# Altium schematic sheet radio.SchDoc
size A4; SheetNumber: 8; SheetTotal: 8
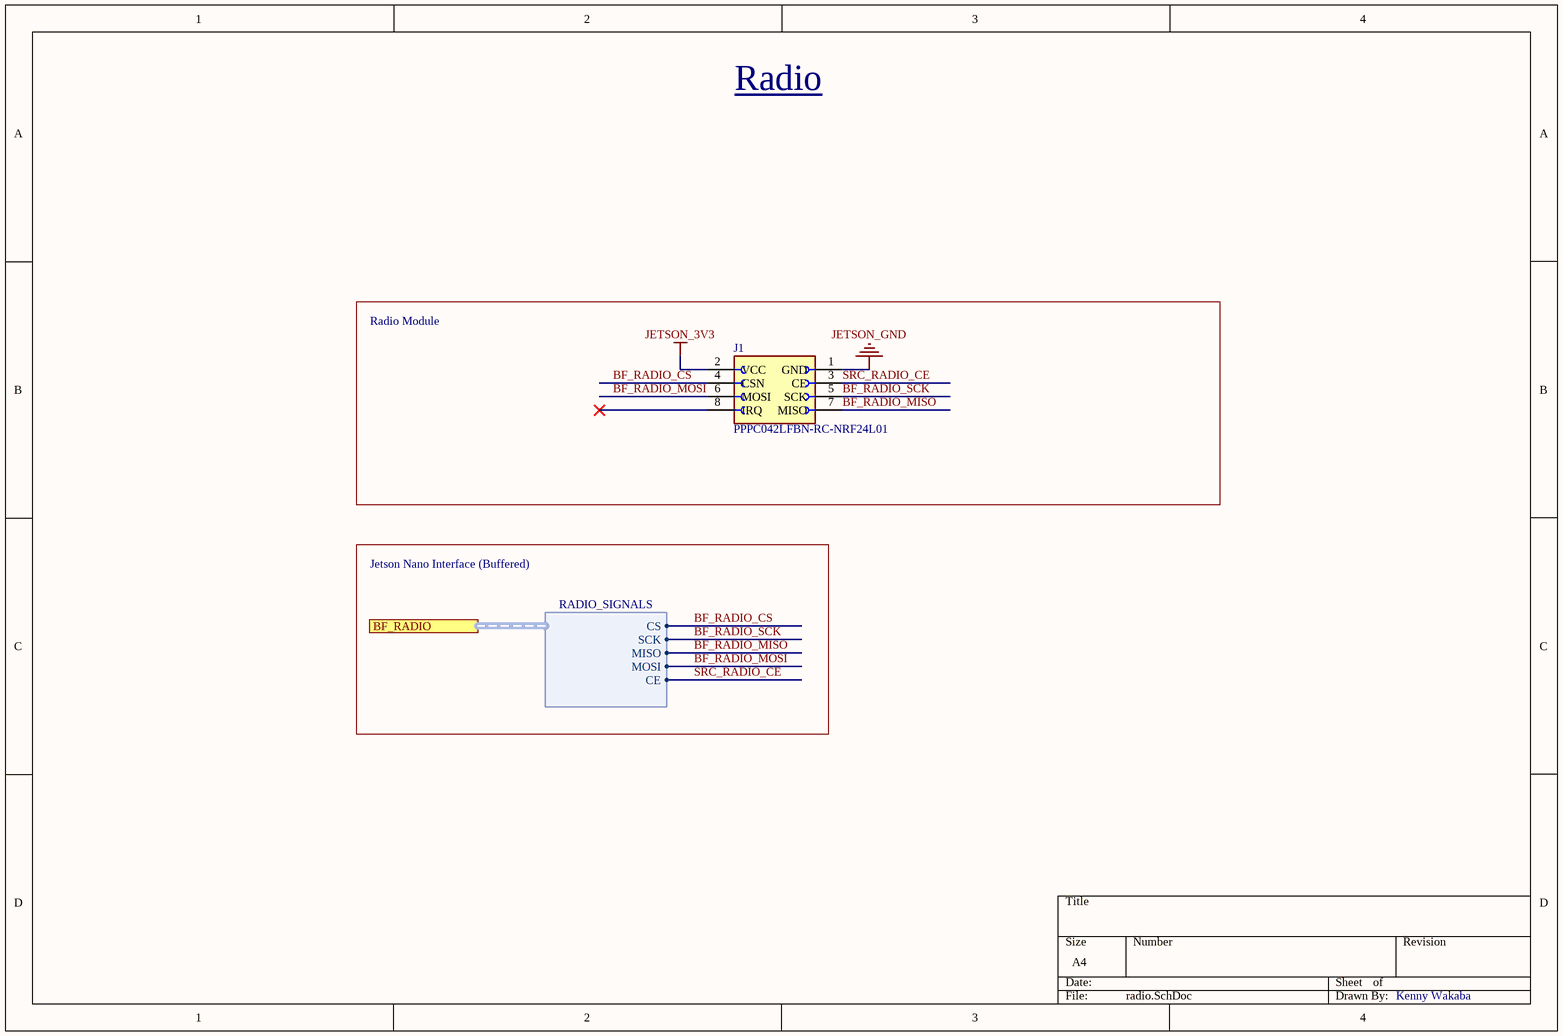
[diagram p0: radio.SchDoc]

## Parts
J1  PPPC042LFBN-RC-NRF24L01  [PPPC042LFBN-RC-NRF24L01]

## Blocks framed on the sheet
Radio Module: J1

## Ports
BF_RADIO (harness RADIO_SIGNALS)

## Harnesses
RADIO_SIGNALS: SCK, MOSI, MISO, CS, CE

## Nets
JETSON_3V3: J1.2(VCC)
JETSON_GND: J1.1(GND)
BF_RADIO_CS: J1.4(CSN) ; port BF_RADIO.CS
BF_RADIO_MISO: J1.7(MISO) ; port BF_RADIO.MISO
BF_RADIO_MOSI: J1.6(MOSI) ; port BF_RADIO.MOSI
BF_RADIO_SCK: J1.5(SCK) ; port BF_RADIO.SCK
SRC_RADIO_CE: J1.3(CE) ; port BF_RADIO.CE

Not connected (* = marked no-connect by the designer): J1 8(IRQ)*

## Notes on the sheet
- Radio
- Jetson Nano Interface (Buffered)
- Kenny Wakaba

## Library data of the parts
J1 = CN PPPC042LFBN-RC-NRF24L01: 8 Position Header Connector 0.100 (2.54mm) Through Hole Gold; MF: Sullins Connector Solutions; SnapEDA_Link: https://www.snapeda.com/parts/PPPC042LFBN-RC/Sullins+Connector+Solutions/view-part/?ref=snap; Package: None; Purchase-URL: https://pricing.snapeda.com/search/part/PPPC042LFBN-RC/?ref=eda; Price: None; Value: *; Check_prices: https://www.snapeda.com/parts/PPPC042LFBN-RC/Sullins+Connector+Solutions/view-part/?ref=eda; MP: PPPC042LFBN-RC; Availability: In Stock; Part Number: CN PPPC042LFBN-RC-NRF24L01; Manufacturer Part Number 1: PPPC042LFBN-RC; Supplier 1: Digi-Key; Supplier Part Number 1: S7107-ND; Supplier URL 1: https://www.digikey.ca/en/products/detail/sullins-connector-solutions/PPPC042LFBN-RC/810244?utm_adgroup=Rectangular%20Connectors%20-%20Headers%2C%20Receptacles%2C%20Female%20Sockets&utm_source=google&utm_medium=cpc&utm_campaign=Shopping_Product_Connectors; Pin Count: 8